# EAGLE design DRL Controller (EAGLE 6.5.0)
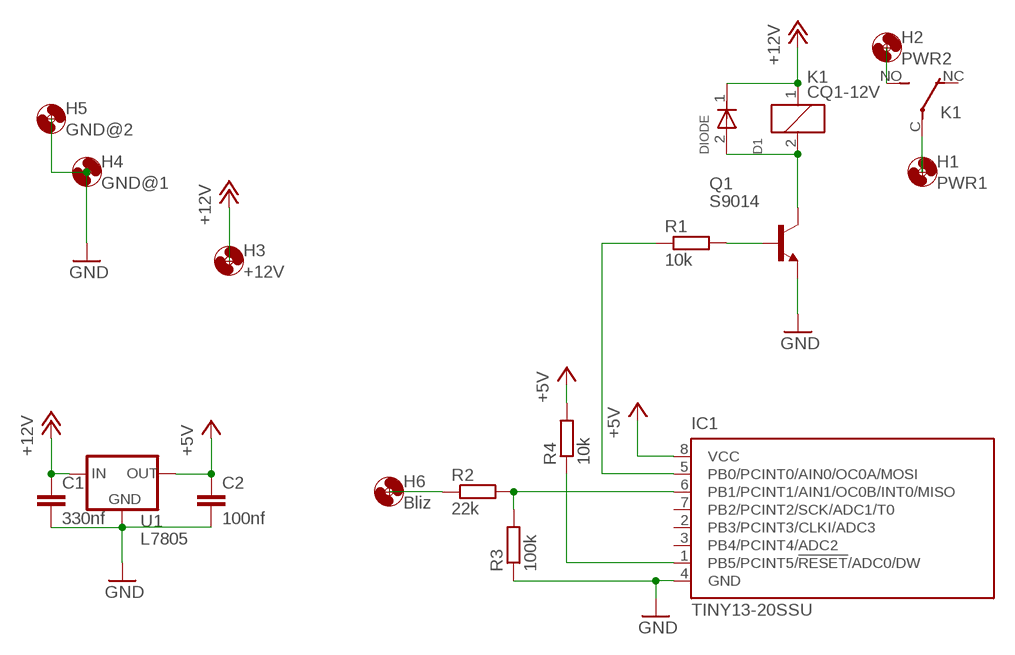
[diagram p0: schematic, sheet 1]

## Parts
C1  330nf  C-EUC0805  [C0805]
C2  100nf  C-EUC0805  [C0805]
D1  DIODE  [SOD80]
H1  PWR1  MOUNT-HOLE3.0  [3,0]
H2  PWR2  MOUNT-HOLE3.0  [3,0]
H3  +12V  MOUNT-HOLE2.8  [2,8]
H4  GND@1  MOUNT-HOLE2.8  [2,8]
H5  GND@2  MOUNT-HOLE3.0  [3,0]
H6  Bliz  MOUNT-HOLE2.8  [2,8]
IC1  TINY13-20SSU  [8S1]
K1  CQ1-12V  [CQ1]
Q1  S9014  2N3904  [TO92]
R1  10k  R-EU_R0805  [R0805]
R2  22k  R-EU_R0805  [R0805]
R3  100k  R-EU_R0805  [R0805]
R4  10k  R-EU_R0805  [R0805]
U1  L7805  L78XX/TO263  [TO263]

## Nets
+5V: C2.1 IC1.8(VCC) R4.2 U1.2(OUT)
+12V: C1.1 D1.1(KATOD) H3.P$1 K1.1 U1.1(IN)
GND: C1.2 C2.2 H4.P$1 H5.P$1 IC1.4(GND) Q1.3(E) R3.1 U1.3(GND)
N$1: D1.2(ANOD) K1.2 Q1.1(C)
N$2: Q1.2(B) R1.2
N$3: H1.P$1 K1.C(2:P)
N$4: H2.P$1 K1.NO(2:S)
N$5: IC1.6(PB1/PCINT1/AIN1/OC0B/INT0/MISO) R2.2 R3.2
N$6: IC1.5(PB0/PCINT0/AIN0/OC0A/MOSI) R1.1
N$7: H6.P$1 R2.1
N$8: IC1.1(PB5/PCINT5/!RESET!/ADC0/DW) R4.1
Unconnected: IC1.2(PB3/PCINT3/CLKI/ADC3) IC1.3(PB4/PCINT4/ADC2) IC1.7(PB2/PCINT2/SCK/ADC1/T0) K1.NC(2:O)

## Library data of the parts
C1 C2 = rcl:C-EU: CAPACITOR, European symbol
D1 = usb:DIODE: DIODE
H1-H6 = holes:MOUNT-HOLE: MOUNTING HOLE with drill center marker
IC1 = atmel:TINY13: 8-bit AVR Microcontroller with 1K Bytes In-System Programmable Flash Source: http://www.atmel.com/dyn/resources/prod_documents/2535S.pdf; MPN: ATTINY13-20SSU; OC_FARNELL: 1455133; OC_NEWARK: 58M3771
K1 = relay:CQ1-12V: AUTOMOTIVE QUIET RELAY NAiS Source: http://www.mew-europe.com/.. en_ds_61208_0000.pdf; OC_FARNELL: unknown; OC_NEWARK: unknown
Q1 = transistor-npn:2N3904: NPN Transistor
R1-R4 = rcl:R-EU_: RESISTOR, European symbol
U1 = v-reg:L78XX/TO263

## Board
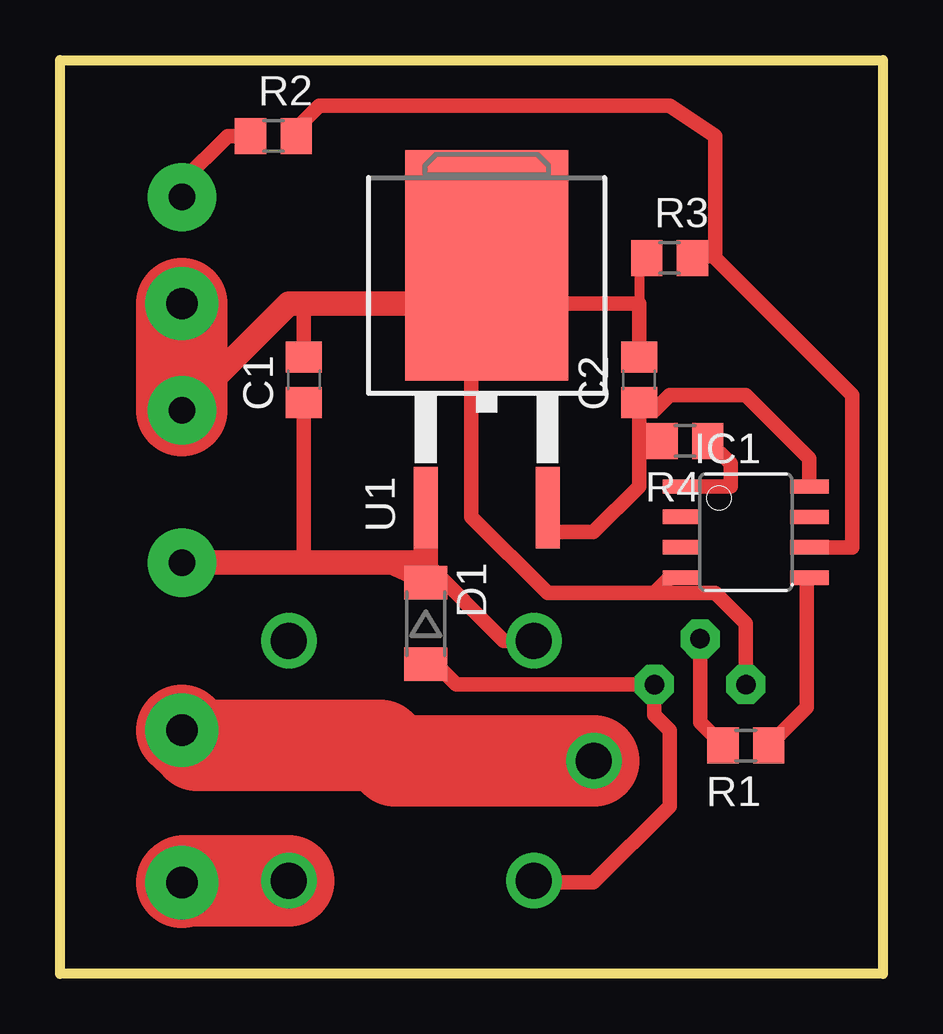
[diagram p1: board, top side]
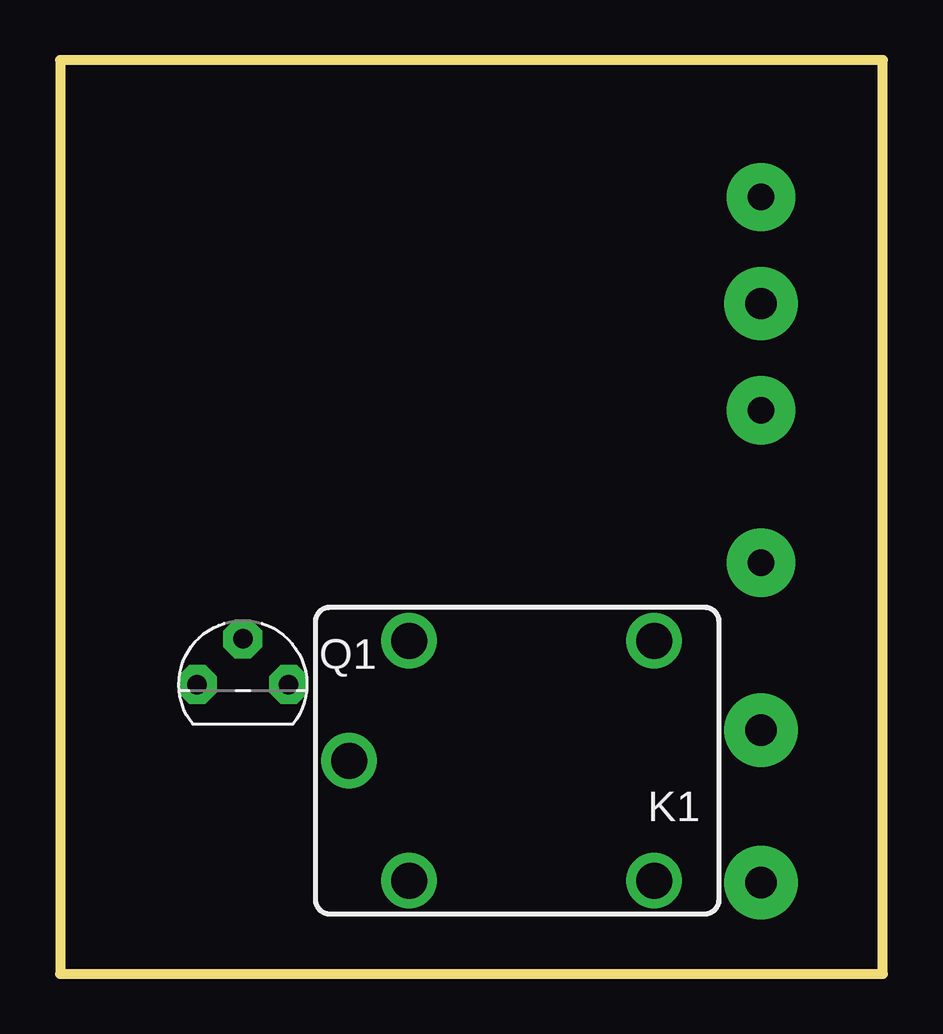
[diagram p2: board, bottom side, seen from below]

Size 34.29 x 38.1 mm. Coordinates in mm from the lower left corner, seen from the top.
Outline: 0,38.1 34.29,38.1 34.29,0 0,0 0,38.1
Copper layers (1*16): Top 0.035mm / dielectric 1.5mm / Bottom 0.035mm
Design rules "default": minimum track width 12mil, minimum drill 32mil, track to track 12mil, track to pad 12mil, pad to pad 12mil, via to via 12mil, smd to smd 8mil, copper to edge 40mil, drill to drill 8mil, minimum pad ring 16mil, minimum via ring 12mil, stop-mask expansion 4mil, vias tented up to drill 0mil, thermal gap 20mil

### Footprints (pad centres in the part's own frame; a part is rotated, then mirrored left to right if it is on the bottom)
C0805 = smd 1.3 x 1.5: 1 -0.95,0; 2 0.95,0
SOD80 = smd 1.4 x 1.8: 1 -1.7,0; 2 1.7,0
3,0 = drill 1.3 pad 3.048: P$1 0,0
2,8 = drill 1.1 pad 2.845: P$1 0,0
8S1 = smd 0.6 x 1.6: 1 -1.905,-2.654; 2 -0.645,-2.654; 3 0.625,-2.654; 4 1.895,-2.654; 5 1.905,2.654; 6 0.635,2.654; 7 -0.635,2.654; 8 -1.905,2.654
CQ1 = drill 1.5: 1 4.5,-5; 2 4.5,5; C 7,0; NC -5.7,-5; NO -5.7,5
TO92 = drill 0.813 octagon: 1 1.905,0; 2 0,1.905; 3 -1.905,0
R0805 = smd 1.3 x 1.5: 1 -0.95,0; 2 0.95,0
TO263 = smd 1 x 3.4: 1 -2.54,-6.6; 2 2.54,-6.6 | smd 6.8 x 9.6: 3 0,3.5

### Placement (x,y rotation side)
C1  10.16,24.77 90 top
C2  24.13,24.77 90 top
D1  15.24,14.61 270 top
H1  5.08,10.16 0 top
H2  5.08,3.81 0 top
H3  5.08,17.14 0 top
H4  5.08,23.5 0 top
H5  5.08,27.94 0 top
H6  5.08,32.38 0 top
IC1  28.57,18.41 270 top
K1  15.24,8.89 180 bottom
Q1  26.67,12.06 0 bottom
R1  28.57,9.53 180 top
R2  8.89,34.92 0 top
R3  25.4,29.84 0 top
R4  26.04,22.23 180 top
U1  17.78,26.04 0 top

### Tracks (layer width: path | path; a pad name or v marks a point on that pad's centre or on a via)
+5V
  Top 0.406: 20.32,18.41 U1.2 | 24.77,23.5 24.13,23.5 24.13,23.18 | 24.13,21.91 25.09,21.91 R4.2
  Top 0.61: 20.32,18.41 22.23,18.41 24.13,20.32 24.13,21.91 24.13,23.18 C2.1 24.45,23.5 24.77,23.5 25.4,24.13 28.57,24.13 31.23,21.48 IC1.8
+12V
  Top 0.6: C1.1 10.16,17.14
  Top 0.61: K1.1 18.5,13.89 15.24,17.14 | D1.1 13.34,17.14
  Top 1.016: H3.P$1 10.16,17.14 13.34,17.14 15.24,17.14 U1.1
GND
  Top 0.406: 10.16,27.94 14.91,27.94 U1.3 18.26,30.32 | 20.64,27.94 18.26,30.32 | 17.14,29.21 18.26,30.32 | IC1.4 25.41,16.52 | R3.1 24.13,29.84 24.13,27.94
  Top 0.6: C1.2 10.16,27.94 | C2.2 24.13,27.94 20.64,27.94 | Q1.3 28.57,14.61 27.3,15.88 24.77,15.88 | 24.77,15.88 20.32,15.88 17.14,19.05 17.14,29.21 | 25.41,16.52 24.77,15.88
  Top 1.016: H4.P$1 9.53,27.94 16.82,27.94 U1.3
  Top 3.81: H5.P$1 H4.P$1
N$1
  Top 0.61: K1.2 19.82,3.81 22.23,3.81 25.4,6.99 25.4,10.16 24.77,10.79 Q1.1 16.51,12.06 15.67,12.9 D1.2
N$2
  Top 0.61: Q1.2 26.67,10.48 R1.2
N$3
  Top 3.81: K1.C 13.97,8.89 13.34,9.53 5.71,9.53 H1.P$1
N$4
  Top 3.81: K1.NO 5.16,3.89 H2.P$1
N$5
  Top 0.406: R3.2 27.3,29.84
  Top 0.61: IC1.6 33.02,17.78 33.02,24.13 27.3,29.84 27.3,34.92 25.4,36.2 10.79,36.2 9.84,35.24 R2.2
N$6
  Top 0.406: IC1.5 31.75,16.51
  Top 0.61: IC1.5 31.11,16.4 31.11,11.12 R1.1
N$7
  Top 0.61: H6.P$1 5.08,33.02 6.99,34.92 R2.1
N$8
  Top 0.61: IC1.1 27.94,20.32 27.94,21.27 R4.1

### Text on the board
tValues: GND | +12